# EAGLE schematic Gameboy Player (EAGLE 9.5.2)
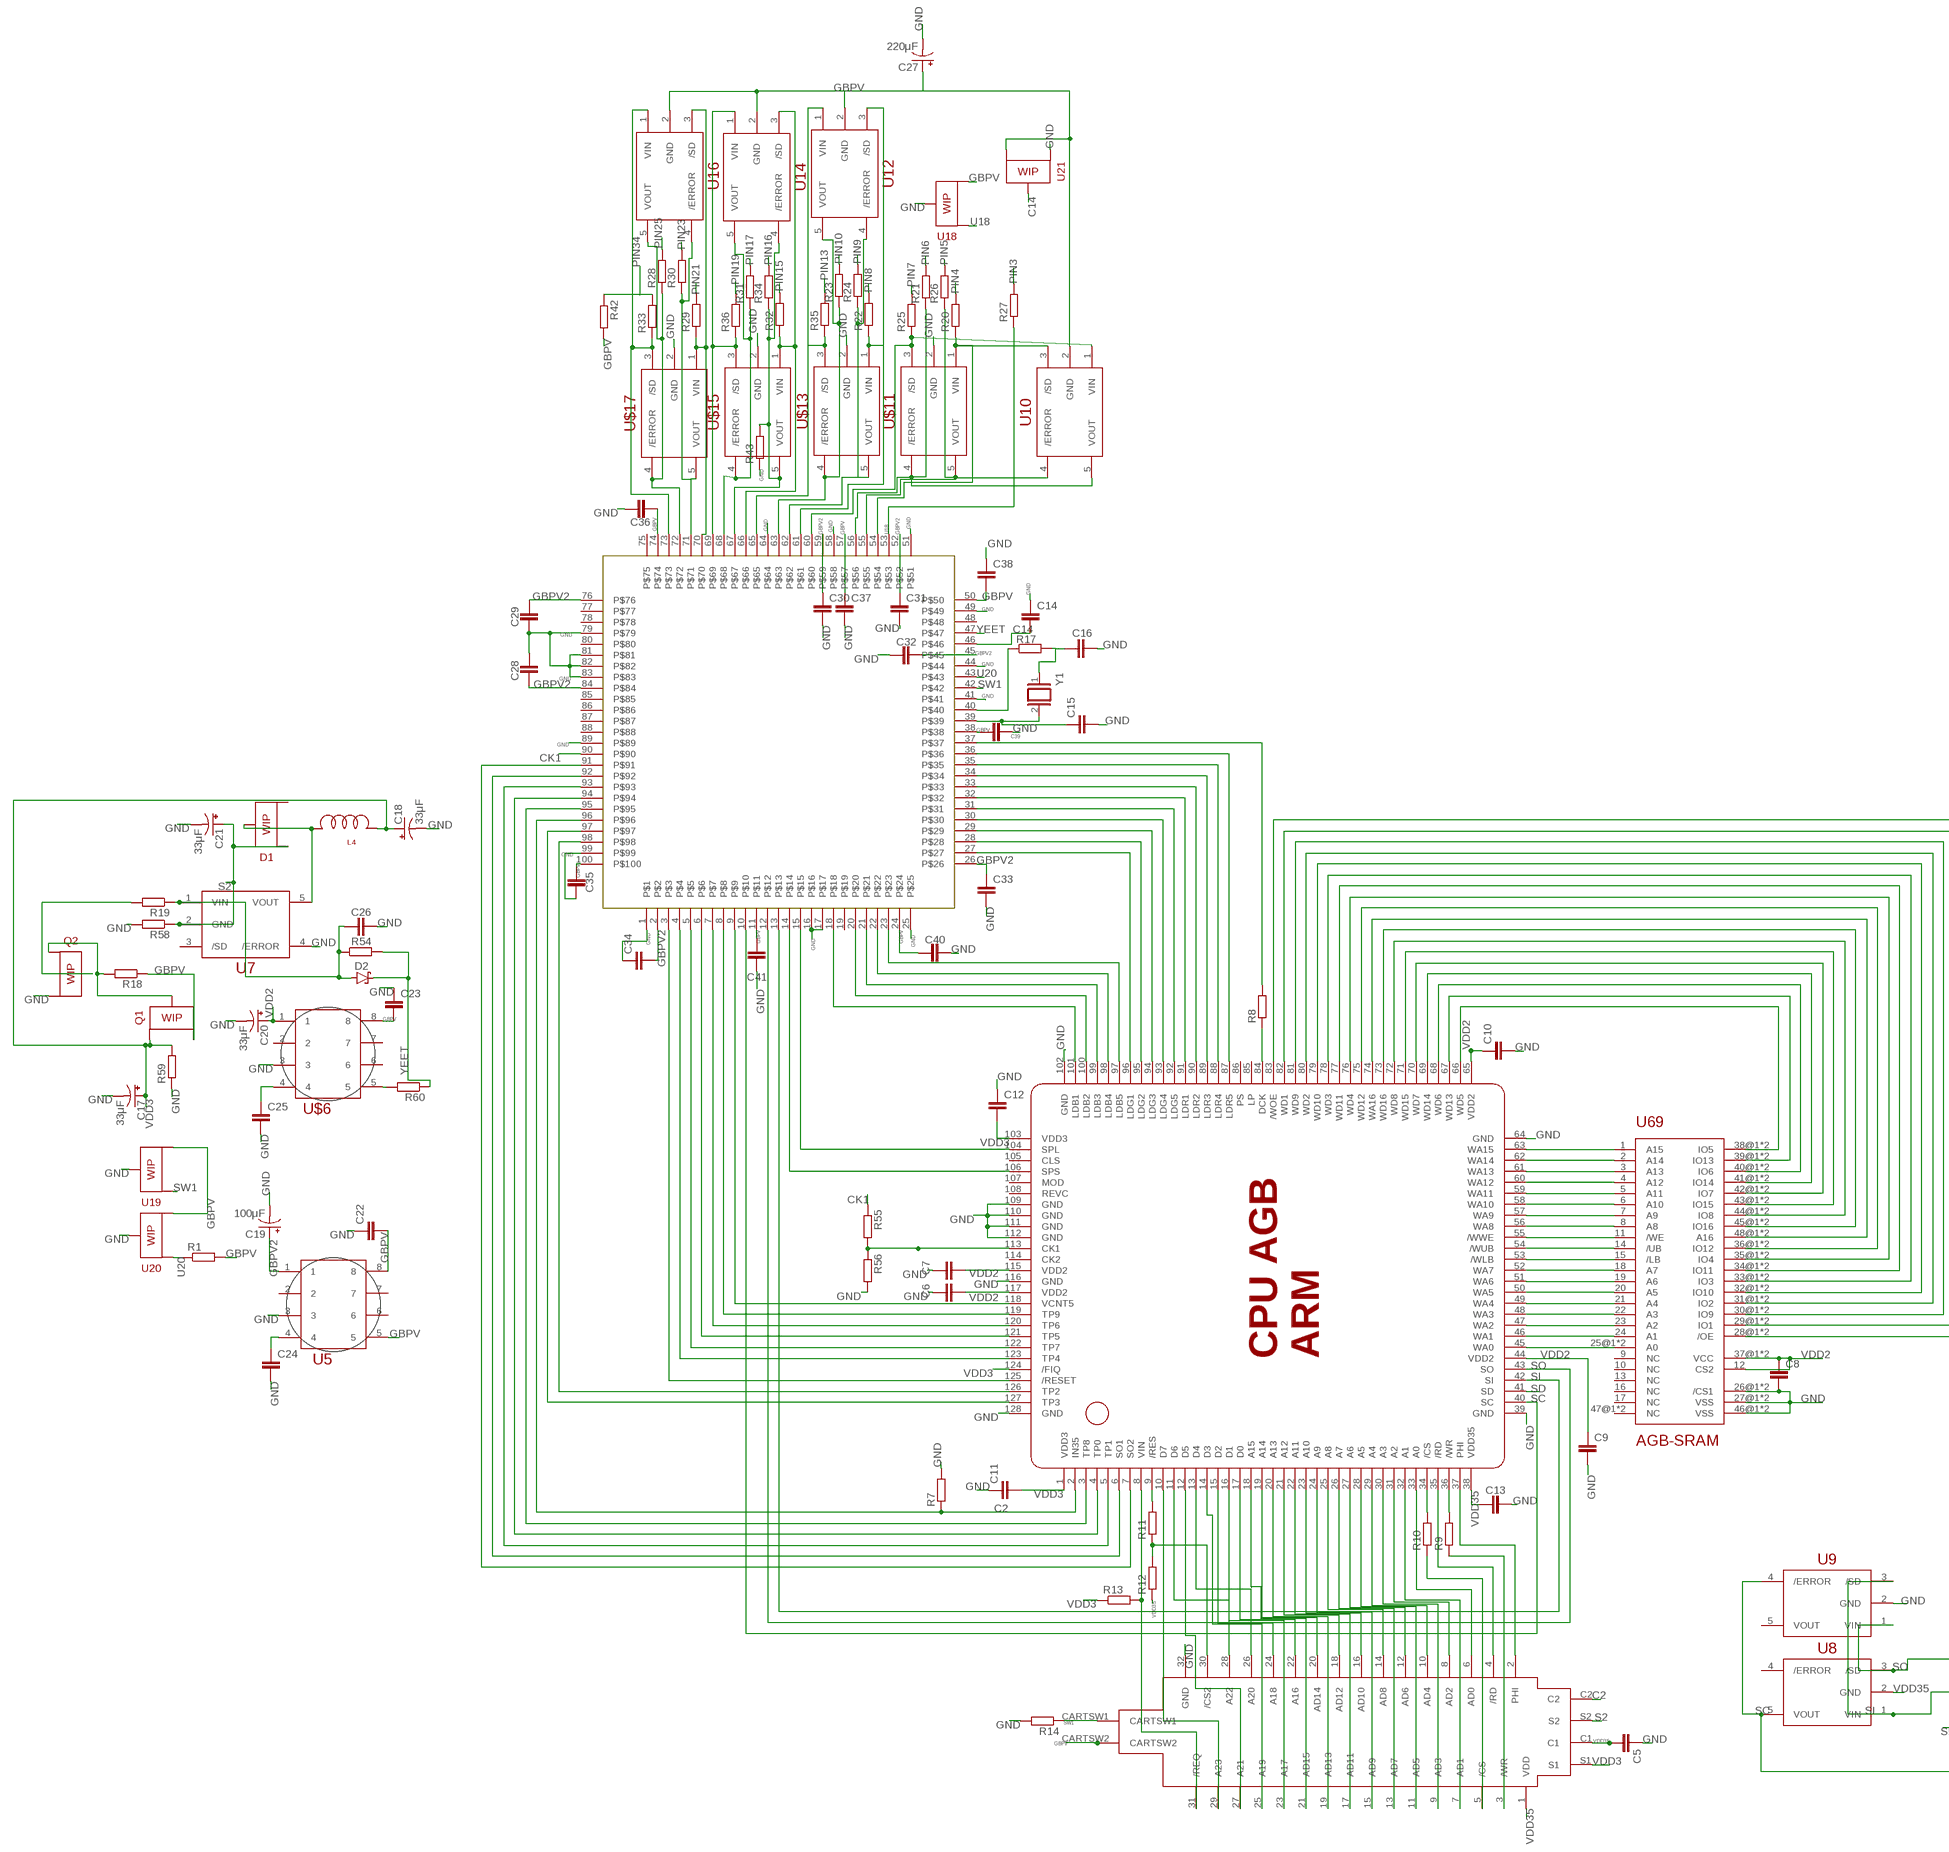
[diagram p0: schematic, sheet 1, part 1 of 2]
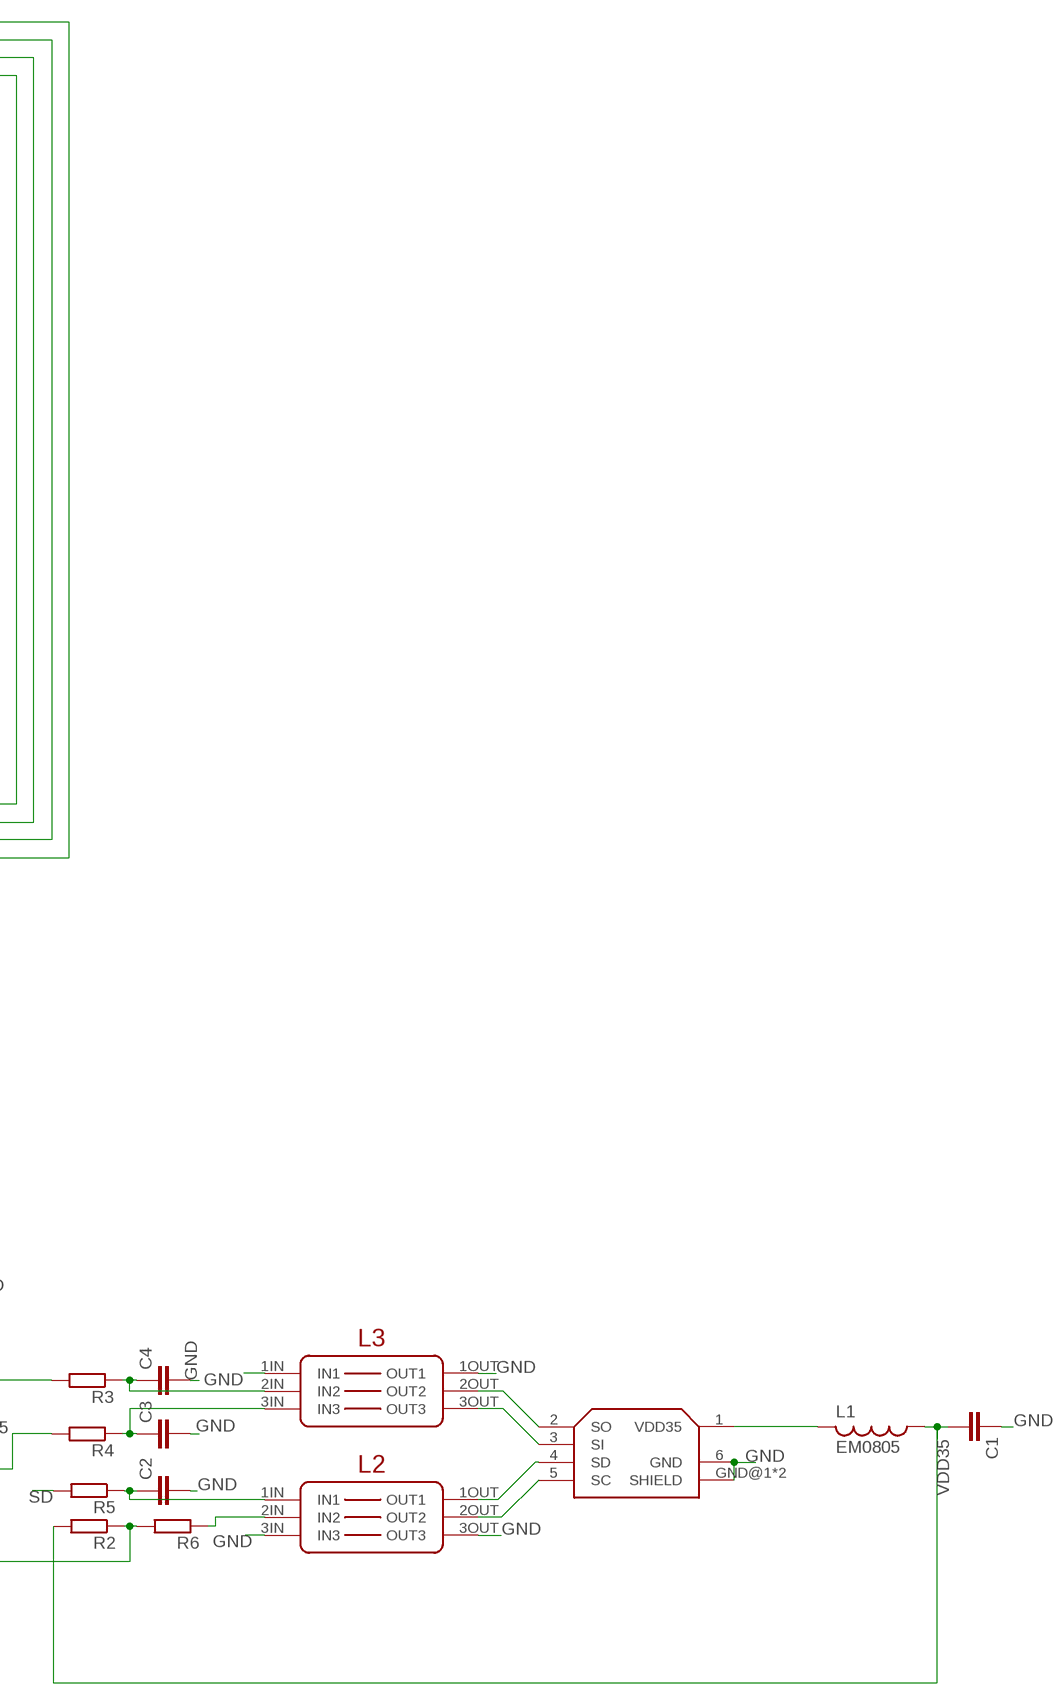
[diagram p1: schematic, sheet 1, part 2 of 2]

## Parts
C1  C-EUC0402  [C0402]
C2  C-EUC0402  [C0402]
C3  C-EUC0402  [C0402]
C4  C-EUC0402  [C0402]
C5  C-EUC0402  [C0402]
C6  C-EUC0402  [C0402]
C7  C-EUC0402  [C0402]
C8  C-EUC0402  [C0402]
C9  C-EUC0402  [C0402]
C10  C-EUC0402  [C0402]
C11  C-EUC0402  [C0402]
C12  C-EUC0402  [C0402]
C13  C-EUC0402  [C0402]
C14  C-EUC0402  [C0402]
C15  C-EUC0402  [C0402]
C16  C-EUC0402  [C0402]
C17  33μF  CPOL-USE  [PANASONIC_E]
C18  33μF  CPOL-USE  [PANASONIC_E]
C19  100μF  CPOL-USE  [PANASONIC_E]
C20  33μF  CPOL-USE  [PANASONIC_E]
C21  33μF  CPOL-USE  [PANASONIC_E]
C22  C-EUC0603  [C0603]
C23  C-EUC0603  [C0603]
C24  C-EUC0402  [C0402]
C25  C-EUC0402  [C0402]
C26  C-EUC0603  [C0603]
C27  220μF  CPOL-USE  [PANASONIC_E]
C28  C-EUC0402  [C0402]
C29  C-EUC0402  [C0402]
C30  C-EUC0402  [C0402]
C31  C-EUC0402  [C0402]
C32  C-EUC0402  [C0402]
C33  C-EUC0402  [C0402]
C34  C-EUC0402  [C0402]
C35  C-EUC0402  [C0402]
C36  C-EUC0402  [C0402]
C37  C-EUC0402  [C0402]
C38  C-EUC0402  [C0402]
C39  C-EUC0402  [C0402]
C40  C-EUC0402  [C0402]
C41  C-EUC0402  [C0402]
D1  GBA-SMD-DIODE-PLACEHOLDER  [GBA-SMD-DIODE-PLACEHOLDER]
D2  BAT60J  [SOD323_ST]
L1  EM0805  [Z0805]
L2  GBA-TRIPLE-EMI-FILTER  [GBA-TRIPLE-EMI-FILTER]
L3  GBA-TRIPLE-EMI-FILTER  [GBA-TRIPLE-EMI-FILTER]
L4  GBA-INDUCTOR  [GBA-INDUCTOR]
Q1  GBA-SMD-DIODE-PLACEHOLDER  [GBA-SMD-DIODE-PLACEHOLDER]
Q2  GBA-SMD-DIODE-PLACEHOLDER  [GBA-SMD-DIODE-PLACEHOLDER]
R1  RR0402  [R0402]
R2  RR0402  [R0402]
R3  RR0402  [R0402]
R4  RR0402  [R0402]
R5  RR0402  [R0402]
R6  RR0402  [R0402]
R7  RR0402  [R0402]
R8  RR0402  [R0402]
R9  RR0402  [R0402]
R10  RR0402  [R0402]
R11  RR0402  [R0402]
R12  RR0402  [R0402]
R13  RR0402  [R0402]
R14  RR0402  [R0402]
R17  RR0402  [R0402]
R18  RR0402  [R0402]
R19  RR0402  [R0402]
R20  RR0402  [R0402]
R21  RR0402  [R0402]
R22  RR0402  [R0402]
R23  RR0402  [R0402]
R24  RR0402  [R0402]
R25  RR0402  [R0402]
R26  RR0402  [R0402]
R27  RR0402  [R0402]
R28  RR0402  [R0402]
R29  RR0402  [R0402]
R30  RR0402  [R0402]
R31  RR0402  [R0402]
R32  RR0402  [R0402]
R33  RR0402  [R0402]
R34  RR0402  [R0402]
R35  RR0402  [R0402]
R36  RR0402  [R0402]
R42  RR0402  [R0402]
R43  RR0402  [R0402]
R54  RR0402  [R0402]
R55  RR0402  [R0402]
R56  RR0402  [R0402]
R58  RR0402  [R0402]
R59  RR0402  [R0402]
R60  RR0402  [R0402]
U5  GBA-TRANSFORMER  [GBA-TRANSFORMER]
U7  GBA-AGB-U10  [GBA-AGB-U10]
U8  GBA-AGB-U10  [GBA-AGB-U10]
U9  GBA-AGB-U10  [GBA-AGB-U10]
U10  GBA-AGB-U10  [GBA-AGB-U10]
U12  GBA-AGB-U10  [GBA-AGB-U10]
U14  GBA-AGB-U10  [GBA-AGB-U10]
U16  GBA-AGB-U10  [GBA-AGB-U10]
U18  GBA-SMD-DIODE-PLACEHOLDER  [GBA-SMD-DIODE-PLACEHOLDER]
U19  GBA-SMD-DIODE-PLACEHOLDER  [GBA-SMD-DIODE-PLACEHOLDER]
U20  GBA-SMD-DIODE-PLACEHOLDER  [GBA-SMD-DIODE-PLACEHOLDER]
U21  GBA-SMD-DIODE-PLACEHOLDER  [GBA-SMD-DIODE-PLACEHOLDER]
U69  TSOP48-SRAM  [TSOP48-SRAM]
U$1  CARTSLOT-DOL-17  [CARTSLOT-DOL-17]
U$2  CPU-AGB-LQFP128  [CPU-AGB-LQFP128]
U$3  EXT-PORT-AGB  [EXT-PORT-AGB]
U$4  REFQFP100  [QFP50P1601X1601X120-100N]
U$6  GBA-TRANSFORMER  [GBA-TRANSFORMER]
U$11  GBA-AGB-U10  [GBA-AGB-U10]
U$13  GBA-AGB-U10  [GBA-AGB-U10]
U$15  GBA-AGB-U10  [GBA-AGB-U10]
U$17  GBA-AGB-U10  [GBA-AGB-U10]
Y1  XTAL/S  [QS]

## Nets
C2: R7.1 U$1.C2 U$2.2(IN35) U$4.96
C14: C14.2 U21.P$2 U$4.46
CK1: R55.1 U$4.90
GBPV: C22.2 C23.2 C27.+ C35.1 C36.2 C37.1 C38.2 C39.2 C40.1 C41.1 Q1.P$3 R1.2 R18.1 R42.2 U5.5 U5.8 U10.2(GND) U12.2(GND) U14.2(GND) U16.2(GND) U18.P$3 U19.P$3 U20.P$3 U21.P$3 U$1.CARTSW2 U$4.11 U$4.24 U$4.38 U$4.50 U$4.57 U$4.74 U$4.100 U$6.8
GBPV2: C19.+ C28.1 C29.2 C30.1 C31.1 C32.2 C33.1 C34.2 U5.1 U$4.2 U$4.26 U$4.45 U$4.52 U$4.59 U$4.76 U$4.84
GND: C1.1 C2.2 C3.2 C4.2 C5.1 C6.1 C7.1 C8.2 C9.2 C10.2 C11.1 C12.1 C13.2 C14.1 C15.2 C16.2 C17.- C18.- C19.- C20.- C21.- C22.1 C23.1 C24.2 C25.2 C26.2 C27.- C28.2 C29.1 C30.2 C31.2 C32.1 C33.2 C34.1 C35.2 C36.1 C37.2 C38.1 C39.1 C40.2 C41.2 L2.3IN(IN3) L2.3OUT(OUT3) L3.1IN(IN1) L3.1OUT(OUT1) Q2.P$3 R7.2 R14.2 R43.1 R56.2 R58.2 R59.1 U5.3 U7.4(/ERROR) U9.2(GND) U18.P$2 U19.P$2 U20.P$2 U21.P$1 U69.26@1(/CS1) U69.26@2(/CS1) U69.27@1(VSS) U69.27@2(VSS) U69.46@1(VSS) U69.46@2(VSS) U$1.32(GND) U$2.39(GND) U$2.64(GND) U$2.102(GND) U$2.109(GND) U$2.110(GND) U$2.111(GND) U$2.112(GND) U$2.116(GND) U$2.128(GND) U$3.6(GND) U$3.GND@1(SHIELD) U$3.GND@2(SHIELD) U$4.1 U$4.16 U$4.17 U$4.25 U$4.41 U$4.44 U$4.49 U$4.51 U$4.58 U$4.64 U$4.79 U$4.81 U$4.82 U$4.83 U$4.89 U$4.99 U$6.3 U$11.2(GND) U$13.2(GND) U$15.2(GND) U$17.2(GND)
N$1: U$2.87(LDR5) U$4.36
N$2: U$2.88(LDR4) U$4.35
N$3: U$2.89(LDR3) U$4.34
N$4: U$2.90(LDR2) U$4.33
N$5: U$2.91(LDR1) U$4.32
N$6: U$2.92(LDG5) U$4.31
N$7: U$2.93(LDG4) U$4.30
N$8: U$2.94(LDG3) U$4.29
N$9: U$2.95(LDG2) U$4.28
N$10: U$2.96(LDG1) U$4.27
N$11: U$2.97(LDB5) U$4.23
N$12: U$2.98(LDB4) U$4.22
N$13: U$2.99(LDB3) U$4.21
N$14: U$2.100(LDB2) U$4.20
N$15: U$2.101(LDB1) U$4.18
N$16: U$2.104(SPL) U$4.15
N$17: U$2.106(SPS) U$4.14
N$18: C15.1 U$4.39 Y1.2
N$20: U$2.3(TP8) U$4.95
N$21: U$2.4(TP0) U$4.94
N$22: U$2.5(TP1) U$4.93
N$23: U$2.6(SO1) U$4.92
N$24: U$2.7(SO2) U$4.91
N$25: U$2.127(TP3) U$4.97
N$26: U$2.126(TP2) U$4.98
N$27: U$2.125(/RESET) U$4.3
N$28: U$2.123(TP4) U$4.4
N$29: U$2.122(TP7) U$4.5
N$30: U$2.121(TP5) U$4.6
N$31: U$2.120(TP6) U$4.7
N$32: U$2.119(TP9) U$4.8
N$33: U$2.118(VCNT5) U$4.9
N$34: R8.1 U$2.84(DCK)
N$35: R8.2 U$4.37
N$39: U69.25@1(A0) U69.25@2(A0) U$2.45(WA0)
N$40: U69.24(A1) U$2.46(WA1)
N$41: U69.23(A2) U$2.47(WA2)
N$42: U69.22(A3) U$2.48(WA3)
N$43: U69.21(A4) U$2.49(WA4)
N$44: U69.20(A5) U$2.50(WA5)
N$45: U69.19(A6) U$2.51(WA6)
N$46: U69.18(A7) U$2.52(WA7)
N$47: U69.15(/LB) U$2.53(/WLB)
N$48: U69.14(/UB) U$2.54(/WUB)
N$49: U69.11(/WE) U$2.55(/WWE)
N$50: U69.8(A8) U$2.56(WA8)
N$51: U69.7(A9) U$2.57(WA9)
N$52: U69.6(A10) U$2.58(WA10)
N$53: U69.5(A11) U$2.59(WA11)
N$54: U69.4(A12) U$2.60(WA12)
N$55: U69.3(A13) U$2.61(WA13)
N$56: U69.2(A14) U$2.62(WA14)
N$57: U69.1(A15) U$2.63(WA15)
N$58: U69.38@1(IO5) U69.38@2(IO5) U$2.66(WD5)
N$59: U69.39@1(IO13) U69.39@2(IO13) U$2.67(WD13)
N$60: U69.40@1(IO6) U69.40@2(IO6) U$2.68(WD6)
N$61: U69.41@1(IO14) U69.41@2(IO14) U$2.69(WD14)
N$62: U69.42@1(IO7) U69.42@2(IO7) U$2.70(WD7)
N$63: U69.43@1(IO15) U69.43@2(IO15) U$2.71(WD15)
N$64: U69.44@1(IO8) U69.44@2(IO8) U$2.72(WD8)
N$65: U69.45@1(IO16) U69.45@2(IO16) U$2.73(WD16)
N$66: U69.48@1(A16) U69.48@2(A16) U$2.74(WA16)
N$67: U69.36@1(IO12) U69.36@2(IO12) U$2.75(WD12)
N$68: U69.35@1(IO4) U69.35@2(IO4) U$2.76(WD4)
N$69: U69.34@1(IO11) U69.34@2(IO11) U$2.77(WD11)
N$70: U69.33@1(IO3) U69.33@2(IO3) U$2.78(WD3)
N$71: U69.32@1(IO10) U69.32@2(IO10) U$2.79(WD10)
N$72: U69.31@1(IO2) U69.31@2(IO2) U$2.80(WD2)
N$73: U69.30@1(IO9) U69.30@2(IO9) U$2.81(WD9)
N$74: U69.29@1(IO1) U69.29@2(IO1) U$2.82(WD1)
N$75: U69.28@1(/OE) U69.28@2(/OE) U$2.83(/WOE)
N$76: U$1.6(AD0) U$2.33(A0)
N$77: R10.1 U$1.5(/CS)
N$78: U$1.4(/RD) U$2.35(/RD)
N$79: R9.1 U$1.3(/WR)
N$80: R10.2 U$2.34(/CS)
N$81: R9.2 U$2.36(/WR)
N$82: U$1.2(PHI) U$2.37(PHI)
N$83: R13.2 U$1.31(/REQ) U$2.8(VIN)
N$84: R11.1 R12.2 U$1.30(/CS2)
N$85: R11.2 U$2.9(/RES)
N$86: U$1.29(A23) U$2.10(D7)
N$87: U$1.28(A22) U$2.11(D6)
N$88: R33.1 U16.1(VIN) U$4.73 U$17.3(/SD)
N$89: U$1.26(A20) U$2.13(D4)
N$90: U$1.7(AD1) U$2.32(A1)
N$91: U$1.8(AD2) U$2.31(A2)
N$92: U$1.9(AD3) U$2.30(A3)
N$93: U$1.10(AD4) U$2.29(A4)
N$94: U$1.11(AD5) U$2.28(A5)
N$95: U$1.12(AD6) U$2.27(A6)
N$96: U$1.13(AD7) U$2.26(A7)
N$97: U$1.14(AD8) U$2.25(A8)
N$98: U$1.15(AD9) U$2.24(A9)
N$99: U$1.16(AD10) U$2.23(A10)
N$100: U$1.17(AD11) U$2.22(A11)
N$101: U$1.18(AD12) U$2.21(A12)
N$102: U$1.19(AD13) U$2.20(A13)
N$103: U$1.20(AD14) U$2.19(A14)
N$104: U$1.21(AD15) U$2.18(A15)
N$105: U$1.22(A16) U$2.17(D0)
N$106: U$1.23(A17) U$2.16(D1)
N$107: U$1.24(A18) U$2.15(D2)
N$108: U$1.25(A19) U$2.14(D3)
N$109: U$1.27(A21) U$2.12(D5)
N$110: R28.1 U16.5(VOUT) U$4.72 U$17.4(/ERROR)
N$111: R30.1 U16.4(/ERROR) U$4.71 U$17.5(VOUT)
N$112: R29.1 U16.3(/SD) U$4.70 U$17.1(VIN)
N$113: R36.1 U14.1(VIN) U$4.69 U$15.3(/SD)
N$114: R31.1 U14.5(VOUT) U$4.68 U$15.4(/ERROR)
N$115: R34.1 R43.2 U14.4(/ERROR) U$4.67 U$15.5(VOUT)
N$116: R32.1 U14.3(/SD) U$4.66 U$15.1(VIN)
N$117: R35.1 U12.1(VIN) U$4.65 U$13.3(/SD)
N$118: R23.1 U12.5(VOUT) U$4.63 U$13.4(/ERROR)
N$119: R24.1 U12.4(/ERROR) U$4.62 U$13.5(VOUT)
N$120: R22.1 U12.3(/SD) U$4.61 U$13.1(VIN)
N$121: R25.1 U10.1(VIN) U$4.60 U$11.3(/SD)
N$122: R21.1 U10.5(VOUT) U$4.56 U$11.4(/ERROR)
N$123: R26.1 U10.4(/ERROR) U$4.55 U$11.5(VOUT)
N$124: R20.1 U10.3(/SD) U$4.54 U$11.1(VIN)
N$125: R17.1 U$4.40
N$126: C16.1 R17.2 Y1.1
N$127: R60.2 U$6.5
N$133: L1.2 U$3.1(VDD35)
N$134: C2.1 L2.1IN(IN1) R5.1
N$135: C3.1 L3.3IN(IN3) R4.1
N$137: L2.2IN(IN2) R6.1
N$138: R55.2 R56.1 U$2.113(CK1)
N$151: C26.1 D2.A R19.1 R54.1 U7.1(VIN)
N$152: C25.1 U$6.4
N$154: Q2.P$2 R19.2
N$155: Q1.P$2 Q2.P$1 R18.2
N$158: C24.1 U5.4
N$160: D1.P$2 L4.2@1 L4.2@2 U7.5(VOUT)
N$168: L2.1OUT(OUT1) U$3.4(SD)
N$169: L2.2OUT(OUT2) U$3.5(SC)
N$170: L3.3OUT(OUT3) U$3.3(SI)
N$171: L3.2OUT(OUT2) U$3.2(SO)
N$172: C4.1 L3.2IN(IN2) R3.1
PIN3: R27.2
PIN4: R20.2
PIN5: R26.2
PIN6: R21.2
PIN7: R25.2
PIN8: R22.2
PIN9: R24.2
PIN10: R23.2
PIN13: R35.2
PIN15: R32.2
PIN16: R34.2
PIN17: R31.2
PIN19: R36.2
PIN21: R29.2
PIN23: R30.2
PIN25: R28.2
PIN34: R33.2 R42.1
S2: C21.+ D1.P$1 R58.1 U7.2(GND) U$1.S2
SC: R2.1 R6.2 U8.5(VOUT) U9.4(/ERROR) U$2.40(SC) U$4.10
SD: R5.2 U$2.41(SD)
SI: R4.2 U8.1(VIN) U9.3(/SD) U$2.42(SI) U$4.13
SO: R3.2 U8.3(/SD) U9.1(VIN) U$2.43(SO) U$4.12
SW1: R14.1 U19.P$1 U$1.CARTSW1 U$4.42
U18: R27.1 U18.P$1 U$4.53
U20: R1.1 U20.P$1 U$4.43
VDD2: C6.2 C7.2 C8.1 C9.1 C10.1 C20.+ U69.12(CS2) U69.37@1(VCC) U69.37@2(VCC) U$2.44(VDD2) U$2.65(VDD2) U$2.115(VDD2) U$2.117(VDD2) U$6.1
VDD3: C11.2 C12.2 C17.+ C18.+ L4.1@1 L4.1@2 Q1.P$1 R13.1 R59.2 U$1.S1 U$2.1(VDD3) U$2.103(VDD3) U$2.124(/FIQ)
VDD35: C1.2 C5.2 C13.1 L1.1 R2.2 R12.1 U8.2(GND) U$1.1(VDD) U$1.C1 U$2.38(VDD35)
YEET: D2.C R54.2 R60.1 U$4.47
Unconnected: D1.P$3 U5.2 U5.6 U5.7 U7.3(/SD) U8.4(/ERROR) U9.5(VOUT) U69.9(NC) U69.10(NC) U69.13(NC) U69.16(NC) U69.17(NC) U69.47@1(NC) U69.47@2(NC) U$2.85(LP) U$2.86(PS) U$2.105(CLS) U$2.107(MOD) U$2.108(REVC) U$2.114(CK2) U$4.19 U$4.48 U$4.75 U$4.77 U$4.78 U$4.80 U$4.85 U$4.86 U$4.87 U$4.88 U$6.2 U$6.6 U$6.7

## Library data of the parts
C1-C16 C22-C26 C28-C41 = rcl:C-EU: CAPACITOR, European symbol; SPICEPREFIX: C
C17-C21 C27 = rcl:CPOL-US: POLARIZED CAPACITOR, American symbol
D1 Q1 Q2 U18-U21 = arcadetv:GBA-SMD-DIODE-PLACEHOLDER
D2 = diode:BAT60J: Schottky barrier diode Source: www.st.com, BAT60J.pdf
L1 = arcadetv:EM0805
L2 L3 = arcadetv:GBA-TRIPLE-EMI-FILTER
L4 = arcadetv:GBA-INDUCTOR
R1-R14 R17-R36 R42 R43 R54-R56 R58-R60 = eagle-ltspice:R: RESISTOR, European symbol; SPICEMODEL: NONE; SPICEPREFIX: R
U5 U$6 = arcadetv:GBA-TRANSFORMER
U7-U10 U12 U14 U16 U$11 U$13 U$15 U$17 = arcadetv:GBA-AGB-U10
U69 = arcadetv:TSOP48-SRAM
U$1 = arcadetv:CARTSLOT-DOL-17
U$2 = arcadetv:CPU-AGB-LQFP128
U$3 = arcadetv:EXT-PORT-AGB
U$4 = ref-packages:REF
Y1 = special:XTAL/S: CRYSTAL